# Altium schematic sheet Micro Controller.SchDoc: Micro Controller
size A4; Author: DODANHLUONG; Revision: 1.0; SheetNumber: 4; SheetTotal: 6; ProjectTitle: KIT ARDUINO VERSION 1.0
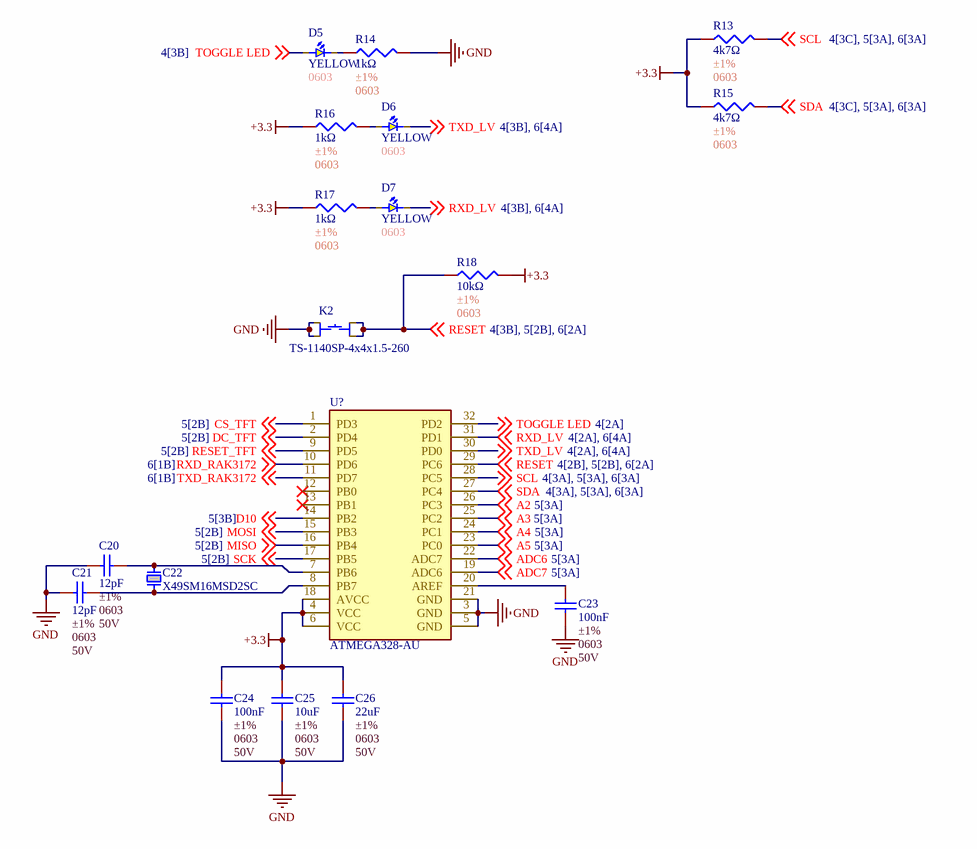
[diagram p0: Micro Controller.SchDoc]

## Parts
C20  12pF  Tolerance: ±1%  Package: 0603  Voltage Rating: 50V  [C0603]
C21  12pF  Tolerance: ±1%  Package: 0603  Voltage Rating: 50V  [C0603]
C22  X49SM16MSD2SC  [X49SM16MSD2SC]
C23  100nF  Tolerance: ±1%  Package: 0603  Voltage Rating: 50V  [C0603]
C24  100nF  Tolerance: ±1%  Package: 0603  Voltage Rating: 50V  [C0603]
C25  10uF  Tolerance: ±1%  Package: 0603  Voltage Rating: 50V  [C0603]
C26  22uF  Tolerance: ±1%  Package: 0603  Voltage Rating: 50V  [C0603]
D5  YELLOW  Package: 0603  [LED0603]
D6  YELLOW  Package: 0603  [LED0603]
D7  YELLOW  Package: 0603  [LED0603]
K2  TS-1140SP-4x4x1.5-260  [4x4x1.5]
R13  4k7Ω  Tolerance: ±1%  Package: 0603  [R0603]
R14  1kΩ  Tolerance: ±1%  Package: 0603  [R0603]
R15  4k7Ω  Tolerance: ±1%  Package: 0603  [R0603]
R16  1kΩ  Tolerance: ±1%  Package: 0603  [R0603]
R17  1kΩ  Tolerance: ±1%  Package: 0603  [R0603]
R18  10kΩ  Tolerance: ±1%  Package: 0603  [R0603]
U?  ATMEGA328-AU  [ATMEGA328-AU]

## Nets
+3.3: C24.1 C25.1 C26.1 R13.1 R15.1 R16.1 R17.1 R18.2 U?.4(VCC) U?.6(VCC) U?.18(AVCC)
GND: C20.2 C21.2 C23.2 C24.2 C25.2 C26.2 K2.1 K2.3 R14.2 U?.3(GND) U?.5(GND) U?.21(GND)
A2: U?.26(PC3) ; off-sheet A2
A3: U?.25(PC2) ; off-sheet A3
A4: U?.24(PC1) ; off-sheet A4
A5: U?.23(PC0) ; off-sheet A5
ADC6: U?.22(ADC7) ; off-sheet ADC6
ADC7: U?.19(ADC6) ; off-sheet ADC7
CS_TFT: U?.1(PD3) ; off-sheet CS_TFT
D10: U?.14(PB2) ; off-sheet D10
DC_TFT: U?.2(PD4) ; off-sheet DC_TFT
MISO: U?.16(PB4) ; off-sheet MISO
MOSI: U?.15(PB3) ; off-sheet MOSI
RESET: K2.2 K2.4 R18.1 U?.29(PC6) ; off-sheet RESET
RESET_TFT: U?.9(PD5) ; off-sheet RESET_TFT
RXD_LV: D7.1 U?.31(PD1) ; off-sheet RXD_LV
RXD_RAK3172: U?.10(PD6) ; off-sheet RXD_RAK3172
SCK: U?.17(PB5) ; off-sheet SCK
SCL: R13.2 U?.28(PC5) ; off-sheet SCL
SDA: R15.2 U?.27(PC4) ; off-sheet SDA
TOGGLE LED: D5.2 U?.32(PD2) ; off-sheet TOGGLE LED
TXD_LV: D6.1 U?.30(PD0) ; off-sheet TXD_LV
TXD_RAK3172: U?.11(PD7) ; off-sheet TXD_RAK3172
NetC20_1: C20.1 C22.2 U?.7(PB6)
NetC21_1: C21.1 C22.1 U?.8(PB7)
NetC23_1: C23.1 U?.20(AREF)
NetD5_1: D5.1 R14.1
NetD6_2: D6.2 R16.2
NetD7_2: D7.2 R17.2

Not connected (* = marked no-connect by the designer): U? 12(PB0)* 13(PB1)*

## Notes on the sheet
- Author:
- Title:
- Size:
- A4
- Project:
- Approved:
- Revision:
- Modified Date:
- CONFIDENTIAL
- Date:
- SW Version:

## Library data of the parts
C20 C21 = C0603_12pF_±1%: 50V 10pF NP0 ±1% 0402 Multilayer Ceramic Capacitors MLCC - SMD/SMT ROHS; Manufacturer: YAGEO; Mfr. Part #: CC0402FRNPO9BN100; LCSC Part #: C513681; Link: https://www.lcsc.com/product-detail/C513681.html?s_z=n_capital%2520yageo%252010pF%25200402; Capacitance: 12pF
C22 = X49SM16MSD2SC: 16MHz Crystal Oscillator 20pF ±20ppm ±30ppm HC-49S-SMD Crystals ROHS; Manufacturer: YXC Crystal Oscillators; Mfr. Part #: X49SM16MSD2SC; LCSC Part #: C12676; Package: HC-49S-SMD; Link: https://www.lcsc.com/product-detail/C12676.html?s_z=n_Crystal%2520Oscillators%2520X49%252016Mhz; Load Capacitance: 20pF
C23 C24 = C0603_100nF_±1%: 50V 10pF NP0 ±1% 0402 Multilayer Ceramic Capacitors MLCC - SMD/SMT ROHS; Manufacturer: YAGEO; Mfr. Part #: CC0402FRNPO9BN100; LCSC Part #: C513681; Link: https://www.lcsc.com/product-detail/C513681.html?s_z=n_capital%2520yageo%252010pF%25200402; Capacitance: 100nF
C25 = C0603_10uF_±1%: 50V 10pF NP0 ±1% 0402 Multilayer Ceramic Capacitors MLCC - SMD/SMT ROHS; Manufacturer: YAGEO; Mfr. Part #: CC0402FRNPO9BN100; LCSC Part #: C513681; Link: https://www.lcsc.com/product-detail/C513681.html?s_z=n_capital%2520yageo%252010pF%25200402; Capacitance: 10uF
C26 = C0603_22uF_±1%: 50V 10pF NP0 ±1% 0402 Multilayer Ceramic Capacitors MLCC - SMD/SMT ROHS; Manufacturer: YAGEO; Mfr. Part #: CC0402FRNPO9BN100; LCSC Part #: C513681; Link: https://www.lcsc.com/product-detail/C513681.html?s_z=n_capital%2520yageo%252010pF%25200402; Capacitance: 22uF
D5-D7 = D0603_YELLOW: 25mcd~40mcd Water Clear -40℃~+85℃ 624nm Red 120° 60mW 0402 LED Indication - Discrete ROHS; Manufacturer: XINGLIGHT; Mfr. Part #: XL-1005UGC; Voltage - Forward(Vf): 3V; LCSC Part #: C965793; Power(Watts): 60mW; Link: https://www.lcsc.com/product-detail/C136765.html?s_z=n_LED%25200402%2520RED; Illumination Color: YELLOW
K2 = TS-1140SP-4x4x1.5-260: SMD Tactile Switches ROHS; Manufacturer: CAX; Mfr. Part #: TS-1140SP-4x4x1.5-260; LCSC Part #: C49023394; Package: SMD; Link: https://www.lcsc.com/product-detail/C49023394.html?s_z=n_button%25204x4
R13 R15 = R0603_4k7Ω_±1%: 62.5mW Thick Film Resistor 50V ±1% ±200ppm/℃ 10Ω 0402 Chip Resistor - Surface Mount ROHS; Manufacturer: YAGEO; Mfr. Part #: RC0402FR-0710RL; LCSC Part #: C138066; Resistance: 4k7Ω; Link: https://www.lcsc.com/product-detail/C138066.html?s_z=n_resistor%25200402%252010R
R14 R16 R17 = R0603_1kΩ_±1%: 62.5mW Thick Film Resistor 50V ±1% ±200ppm/℃ 10Ω 0402 Chip Resistor - Surface Mount ROHS; Manufacturer: YAGEO; Mfr. Part #: RC0402FR-0710RL; LCSC Part #: C138066; Resistance: 1kΩ; Link: https://www.lcsc.com/product-detail/C138066.html?s_z=n_resistor%25200402%252010R
R18 = R0603_10kΩ_±1%: 62.5mW Thick Film Resistor 50V ±1% ±200ppm/℃ 10Ω 0402 Chip Resistor - Surface Mount ROHS; Manufacturer: YAGEO; Mfr. Part #: RC0402FR-0710RL; LCSC Part #: C138066; Resistance: 10kΩ; Link: https://www.lcsc.com/product-detail/C138066.html?s_z=n_resistor%25200402%252010R
U? = ATMEGA328-AU: AVR 20MHz TQFP-32(7x7) Microcontrollers (MCU/MPU/SOC) ROHS; Manufacturer: MICROCHIP; Voltage - Supply: 1.8V~5.5V; Program Storage Size: 32KB; ADC (Bit): 10bit; Number of I/O: 23; LCSC Part #: C618731; Package: TQFP-32(7x7); CPU Core: AVR; CPU Maximum Speed: 20MHz; Mfr. Part #: ATMEGA328-AU; Link: https://www.lcsc.com/product-detail/C618731.html?s_z=n_C618731